# EAGLE design Prova (EAGLE 6.5.0)

## Sheet 1 of 2
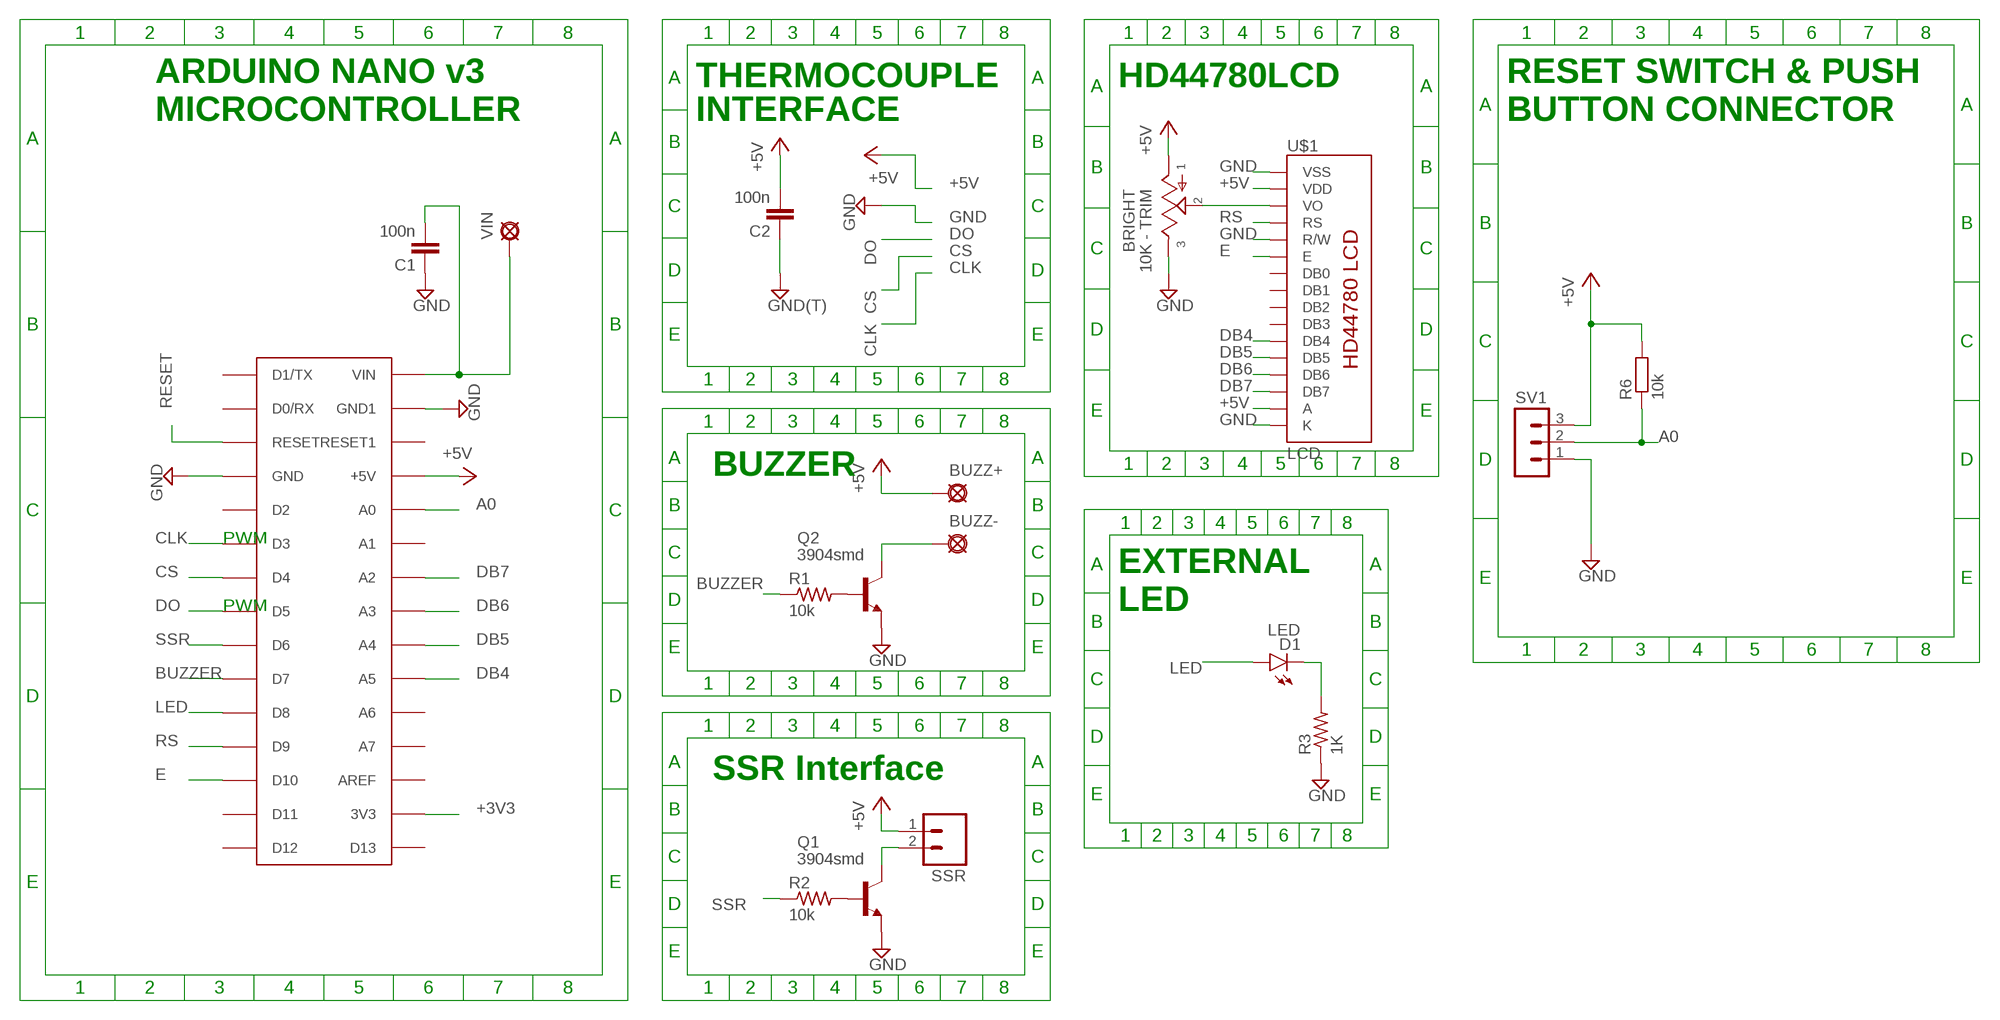
[diagram p0: schematic, sheet 1]

### Parts
ARDUINO  Arduino Nano v3.0  ARDUINONANO  [PDIP-32]
BRIGHT  10K - TRIM  POTTRIM  [B25P]
BUZZ+  PAD  [SQUARE]
BUZZ-  PAD8  [OCTOGON]
C1  100n  CAP0805  [0805]
C2  100n  CAP0805  [0805]
D1  LED  LED3MM  [LED3MM]
GND8  GND(T)  [SQUARE]
Q1  3904smd  BC850SMD  [SOT23-BEC]
Q2  3904smd  BC850SMD  [SOT23-BEC]
R1  10k  6MM.3  [R0207/3]
R2  10k  6MM.3  [R0207/3]
R3  1K  6MM.3  [R0207/3]
R6  10k  R-EU_M0805  [M0805]
SSR  M023.5MM  [SCREWTERMINAL-3.5MM-2]
SV1  MA03-1  [MA03-1]
U$1  LCD  LCD-HD44780  [LCD-16X2-PIN]
VIN  PAD  [SQUARE]

### Nets
+3V3: ARDUINO.3V3 ; also sheet 2
+5V: ARDUINO.+5V BRIGHT.1 BUZZ+.1(PAD) C2.2 R6.2 SSR.1 SV1.3 U$1.2(VDD) U$1.15(A)
A0: ARDUINO.A0 R6.1 SV1.2
BUZZER: ARDUINO.D7 R1.1
CLK: ARDUINO.D3 ; also sheet 2
CS: ARDUINO.D4 ; also sheet 2
DB4: ARDUINO.A5 U$1.11(DB4)
DB5: ARDUINO.A4 U$1.12(DB5)
DB6: ARDUINO.A3 U$1.13(DB6)
DB7: ARDUINO.A2 U$1.14(DB7)
DO: ARDUINO.D5 ; also sheet 2
E: ARDUINO.D10 U$1.6(E)
GND: ARDUINO.GND ARDUINO.GND1 BRIGHT.3 C1.1 C2.1 GND8.1(GND) Q1.E Q2.E R3.1 SV1.1 U$1.1(VSS) U$1.5(R/W) U$1.16(K) ; also sheet 2
LED: ARDUINO.D8 D1.A
N$1: Q2.B R1.2
N$2: Q1.C SSR.2
N$3: Q1.B R2.2
N$4: BUZZ-.1(PAD) Q2.C
N$5: BRIGHT.2 U$1.3(VO)
N$6: D1.K(C) R3.2
RESET: ARDUINO.RESET
RS: ARDUINO.D9 U$1.4(RS)
SSR: ARDUINO.D6 R2.1
VIN: ARDUINO.VIN C1.2 VIN.1(PAD)
Unconnected: ARDUINO.A1 ARDUINO.A6 ARDUINO.A7 ARDUINO.AREF ARDUINO.D0/RX ARDUINO.D1/TX ARDUINO.D2 ARDUINO.D11 ARDUINO.D12 ARDUINO.D13 ARDUINO.RESET1 U$1.7(DB0) U$1.8(DB1) U$1.9(DB2) U$1.10(DB3)

### Notes on the sheet
- THERMOCOUPLE | HD44780LCD
- ARDUINO NANO v3
  MICROCONTROLLER
- INTERFACE
- RESET SWITCH & PUSH
  BUTTON CONNECTOR
- BUZZER
- PWM
- PWM
- EXTERNAL
  LED
- SSR Interface

## Sheet 2 of 2
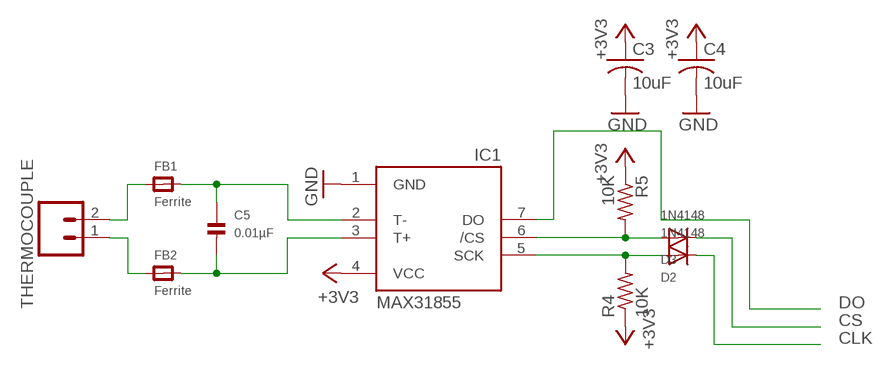
[diagram p1: schematic, sheet 2]

### Parts
C3  10uF  C-USC0805K  [C0805K]
C4  10uF  C-USC0805K  [C0805K]
C5  0.01µF  CAP_CERAMIC_0805  [_0805]
D2  1N4148  DIODEDO-1N4148  [DO-1N4148]
D3  1N4148  DIODEDO-1N4148  [DO-1N4148]
FB1  Ferrite  FERRITE_0805  [_0805]
FB2  Ferrite  FERRITE_0805  [_0805]
IC1  MAX31855  MAX6675  [SO08]
R4  10K  R-US_R0805  [R0805]
R5  10K  R-US_R0805  [R0805]
THERMOCOUPLE  M023.5MM  [SCREWTERMINAL-3.5MM-2]

### Nets
+3V3: C3.1 C4.1 IC1.4(VCC) R4.1 R5.1 ; also sheet 1
CLK: D2.C ; also sheet 1
CS: D3.C ; also sheet 1
CS1: D3.A IC1.6(/CS) R5.2
DO: IC1.7(DO) ; also sheet 1
GND: C3.2 C4.2 IC1.1(GND) ; also sheet 1
N$9: FB1.1 THERMOCOUPLE.2
N$10: C5.1 FB1.2 IC1.2(T-)
N$11: FB2.1 THERMOCOUPLE.1
N$12: C5.2 FB2.2 IC1.3(T+)
SCK: D2.A IC1.5(SCK) R4.2

## Library data of the parts
ARDUINO = jet-lib:ARDUINONANO
BRIGHT = gm-pots:POT: Potentiometers the arrow indicates the clockwise motion of th wiper (lug 2) fully counter clockwise there is no resistance between lugs 1 and 2 fully clockwise the resistance between lugs 1 and 2 is the value of the pot
BUZZ+ BUZZ- VIN = gm-supply:PAD: PAD use this package for pads with any purpose, including input, output, send or return various pad shapes: round, square, octogonal, long, and long offset
C1 C2 = SparkFun-Capacitors:CAP: Capacitor Standard 0603 ceramic capacitor, and 0.1" leaded capacitor.
C3 C4 = adafruit:C-US: CAPACITOR, American symbol
C5 = microbuilder:CAP_CERAMIC: Ceramic Capacitors 0402 - 0402 Surface Mount Capacitors 16pF 50V 5% [Digikey: 445-4899-2-ND] 18pF 50V 5% [Digikey: 490-1281-2-ND] 22pF 50V 5% [Digikey: 490-1283-2-ND] 68pF 50V 5% [Digikey: 490-1289-2-ND] 0.1uF 10V 10% [Digikey: 490-1318-2-ND] 1.0uF 6.3V 10% [Digikey: 490-1320-2-ND] 0603 - 0603 Surface Mount Capacitors 16 pF 50V 5% [Digikey: 445-5051-2-ND] 22 pF 50V [Digikey: PCC220ACVTR-ND] 33 pF 50V 5% [Digikey: 490-1415-1-ND] 56pF 50V 5% [Digikey: 490-1421-1-ND] 220pF 50V 5% [Digikey: 445-1285-1-ND] 680 pF 50V 2200 pF 50V 5% C0G [Digikey: 445-1297-1-ND] 5600 pF 100V 5% X7R [Digikey: 478-3711-1-ND] 0.1 µF 25V 10% [Digikey: PCC2277TR-ND] 0.22 µF 16V 10% X7R [Digikey: 445-1318-1-ND] 1.0 µF 25V 10% [Digikey: 445-5146-2-ND] 0603 - RF Specific 3pF 250V +/-0.1pF RF [Digikey: 712-1347-1-ND] 18 pF 250V 5% [Digikey: 478-3505-1-ND or 712-1322-1-ND] 56 pF 250V 5% C0G RF [Digikey: 490-4867-1-ND] 68 pF 250V RF [Digikey: 490-4868-1-ND] 0805 - 0805 Surface Mount Capacitors 220 pF 250V 2% RF Ceramic Capacitor [Digikey: 712-1398-1-ND] 1000 pF 50V 2% NP0 Ceramic Capacitor [Digikey: 478-3760-1-ND] 0.1 µF 25V 10% Ceramic Capacitor [Digikey: PCC1828TR-ND] 1.0 µF 16V 10% Ceramic Capacitor[Digikey: 490-1691-2-ND] 10.0 µF 10V 10% Ceramic Capacitor[Digikey: 709-1228-1-ND] 10.0 uF 16V 10% Ceramic Capacitor [Digikey: 478-5165-2-ND] 47 uF 6.3V 20% Ceramic Capacitor [Digikey: 587-1779-1-ND or 399-5506-1-ND] 1206 - 1206 Surface Mount Capacitors 47uF 10V 20% Ceramic Capacitor [Digikey: 490-5528-1-ND or 399-5508-1-ND or 445-6010-1-ND] 100uF 6.3V -20%, +80% Y5V Ceramic Capacitor (Digikey: 490-4512-1-ND, Mouser: 81-GRM31CF50J107ZE1L)
D1 = gm-diodes:LED
D2 D3 = adafruit:DIODE: Diode SMADIODE - SMA Surface Mount Package 20V 1A Schottky Diode Digikey: 641-1014-6-ND DO-1N4148 - Through Hole Small Current Diode SOD-123 20V 1 A (.5mV Vf) Schottky Diode - Digikey: MBRX120TPMSCT-ND SOD-323 10V 570mA (.38mV Vf, 3ns) Schottky Diode - Digikey: ZLLS410CT-ND SOD-523 30V 30mA Schottky Diode (RB751S-40TE61) - Digikey: RB751S-40TE61CT-ND SOT23-R/W - SOT23 Package (R = Solder Paste/Reflow Ovens, W = Hand-Soldering) BAT54Film 40V 300mA - Digikey: 497-7162-1-ND
FB1 FB2 = microbuilder:FERRITE: Ferrite Bead 0603 MMZ1608B121C - 120 Ohm @ 100MHz, 600mA, 0.15 Ohm DC Resistance - Digikey: 445-2164-1-ND BK1608HW121-T - 120 Ohm, 600mA Ferrite Chip - Digikey: 587-1876-2-ND 0805 HZ0805B272R-10 - 2.7K Ohm @ 100MHz, 200mA, 0.8 Ohm DC Resistance - Digikey: 240-2504-1-ND (see also Murata BLM21BD272SN1L) MMZ2012Y152B - 1.5K Ohm @ 100MHz, 500mA, 0.4 Ohm DC Resistance - Digikey: 445-1560-1-ND - Mainly for high frequency (80-400MHz) MMZ2012R102A - 1K Ohm @ 100MHz, 500mA, 0.3 Ohm DC Resistance - Digikey: 445-1555-2-ND - More general purpose (10-200MHz)
GND8 = gm-supply:GND(T): Ground use this to hook up ground (GND) throughout a schematic instead of running wire automatically labels the net "GND" adds a hookup pad to the circuit board (you can use several)
IC1 = adafruit:MAX6675
Q1 Q2 = transistor-npn:BC850*: NPN Transistor
R1-R3 = gm-resistors:6MM: 6mm Resistors Leads spaced 1-6 holes apart for 0.1" perfboard. Suitable for 1/4 watt resistors.
R4 R5 = adafruit:R-US_: RESISTOR, American symbol
R6 = rcl:R-EU_: RESISTOR, European symbol
SSR THERMOCOUPLE = SparkFun-Connectors:M02: Standard 2-pin 0.1" header. Use with - straight break away headers ( PRT-00116) - right angle break away headers (PRT-00553) - swiss pins (PRT-00743) - machine pins (PRT-00117) - female headers (PRT-00115) Molex polarized connector foot print use with: PRT-08233 with associated crimp pins and housings. 2.54_SCREWTERM for use with PRT-10571. 3.5mm Screw Terminal footprints for PRT-08084 5mm Screw Terminal footprints for use with PRT-08432; PROD_ID: CONN-08399
SV1 = con-lstb:MA03-1: PIN HEADER; OC_FARNELL: unknown; OC_NEWARK: unknown
U$1 = HD44780LCD:LCD-HD44780

## Board
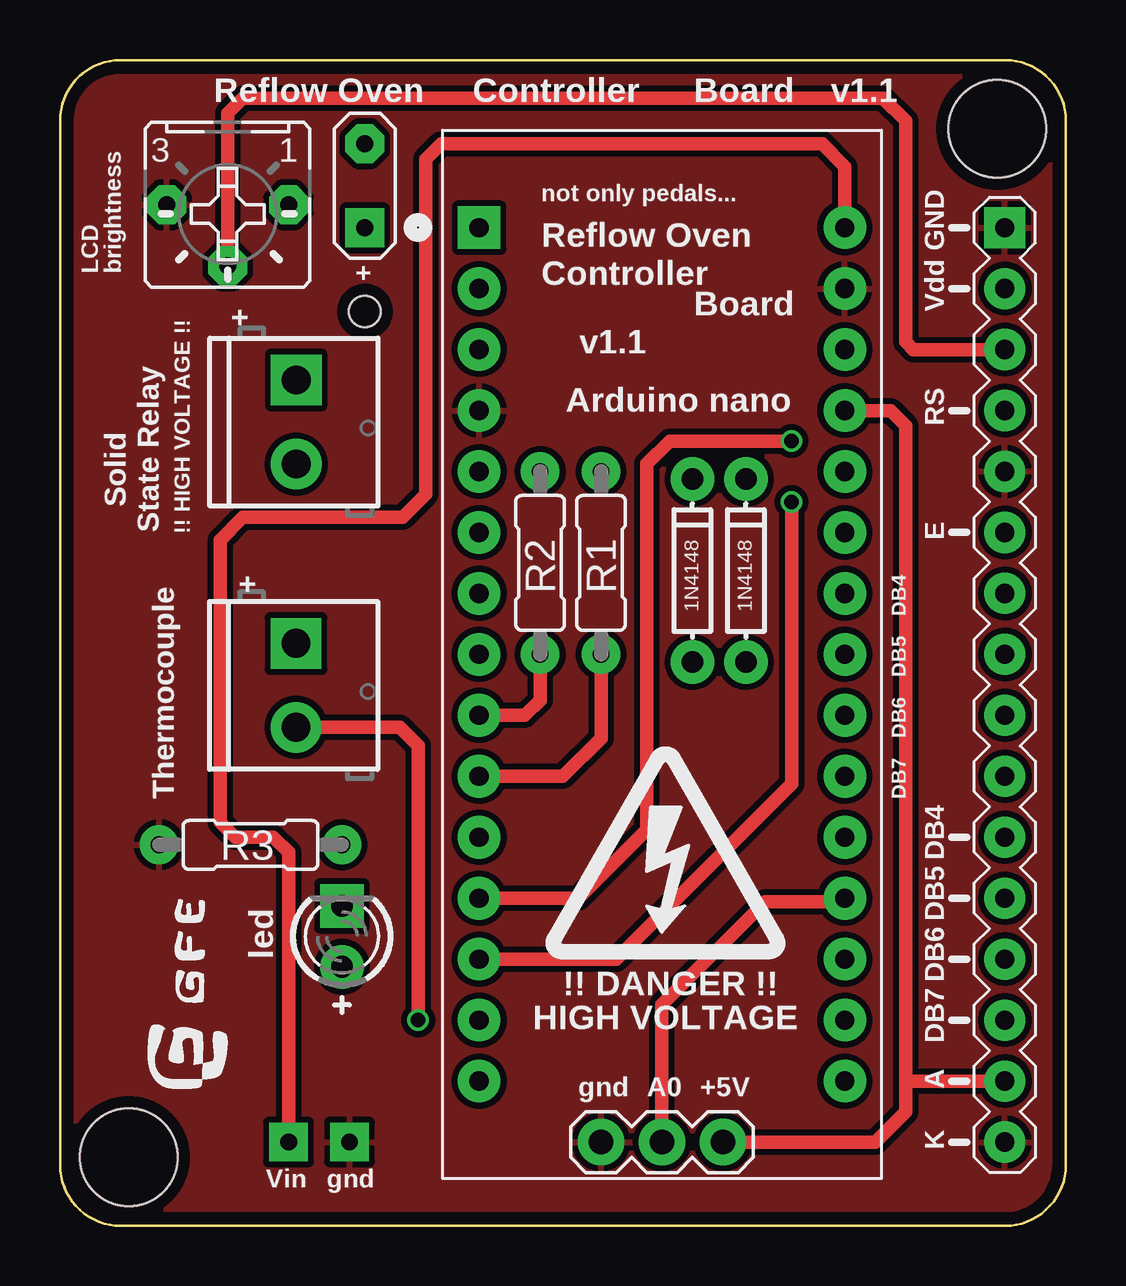
[diagram p2: board, top side]
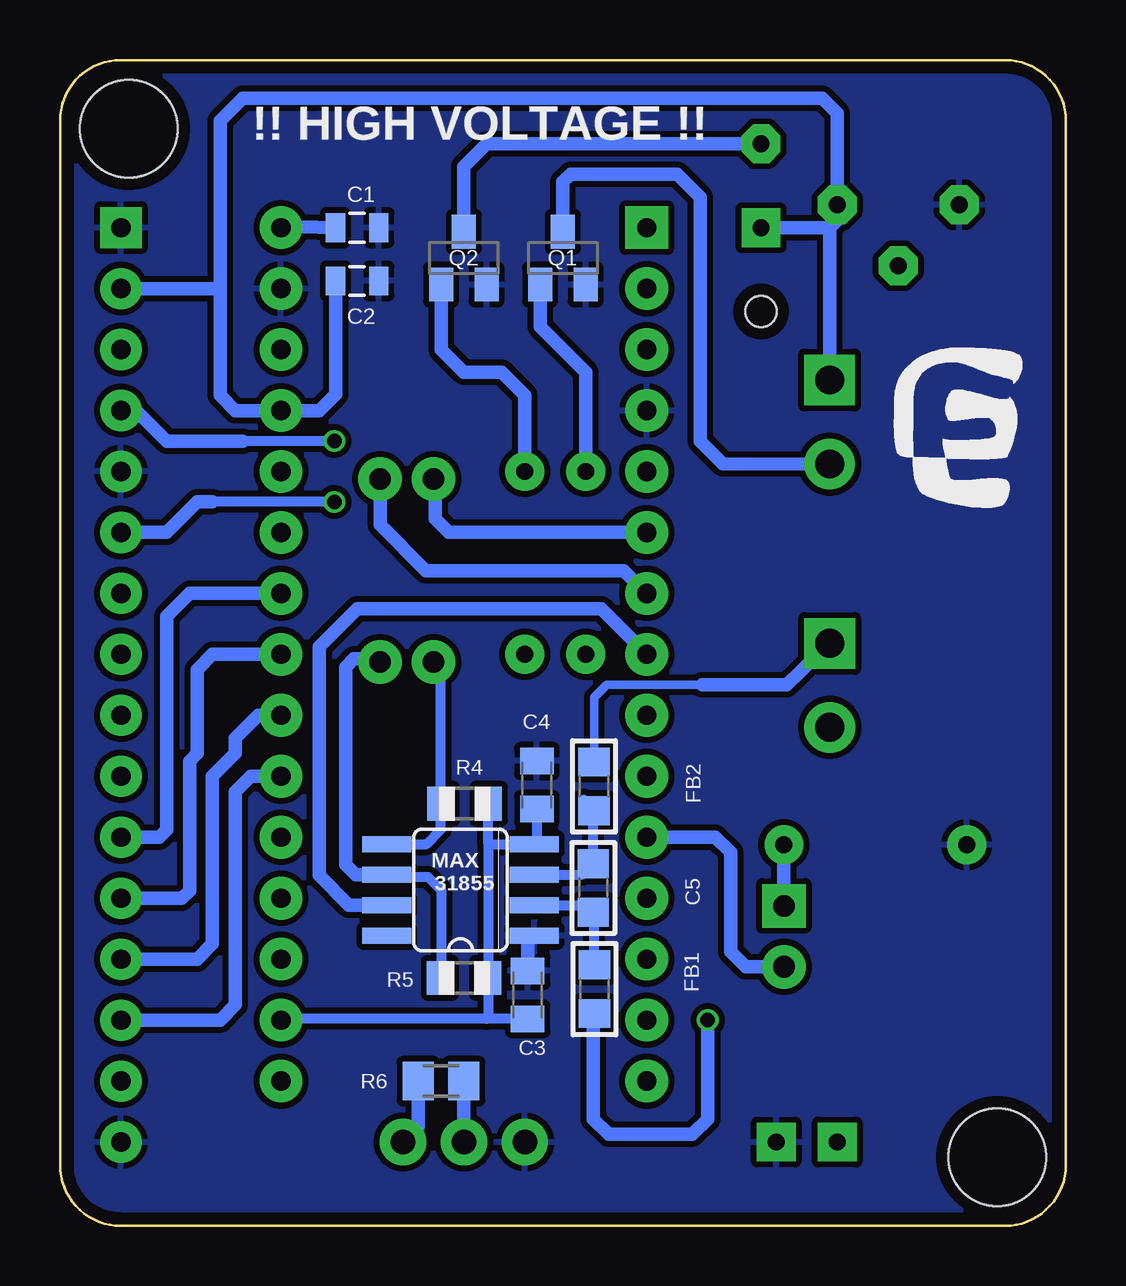
[diagram p3: board, bottom side, seen from below]

Size 41.91 x 48.58 mm. Coordinates in mm from the lower left corner, seen from the top.
Outline: 0,46.04 arc-90 2.54,48.58 39.37,48.58 arc-90 41.91,46.04 41.91,2.54 arc-90 39.37,0 2.54,0 arc-90 0,2.54 0,46.04
Copper layers (1*16): Top 0.035mm / dielectric 1.5mm / Bottom 0.035mm
Design rules "Smart Prototyping": minimum track width 7mil, minimum drill 12mil, track to track 7mil, track to pad 7mil, pad to pad 7mil, via to via 7mil, smd to smd 0mil, copper to edge 20mil, drill to drill 10mil, minimum pad ring 18mil, minimum via ring 6mil, stop-mask expansion 2mil, vias tented up to drill 25mil, thermal gap 10mil
Holes 4.06 mm at 2.86,2.86 39.05,45.72
Holes 1.3 mm at 12.7,38.1

### Footprints (pad centres in the part's own frame; a part is rotated, then mirrored left to right if it is on the bottom)
PDIP-32 = drill 0.8 pad 1.778: 3V3 15.24,-35.56; +5V 15.24,-10.16; A0 15.24,-30.48; A1 15.24,-27.94; A2 15.24,-25.4; A3 15.24,-22.86; A4 15.24,-20.32; A5 15.24,-17.78; A6 15.24,-15.24; A7 15.24,-12.7; AREF 15.24,-33.02; D0/RX 0,-5.08; D2 0,-12.7; D3 0,-15.24; D4 0,-17.78; D5 0,-20.32; D6 0,-22.86; D7 0,-25.4; D8 0,-27.94; D9 0,-30.48; D10 0,-33.02; D11 0,-35.56; D12 0,-38.1; D13 15.24,-38.1; GND 0,-10.16; GND1 15.24,-5.08; RESET 0,-7.62; RESET1 15.24,-7.62; VIN 15.24,-2.54 | drill 0.8 pad 1.778 square: D1/TX 0,-2.54
B25P = drill 0.7 octagon: 1 -2.54,0; 2 0,2.54; 3 2.54,0
SQUARE = drill 0.7 square: 1 0,0
OCTOGON = drill 0.7 octagon: 1 0,0
0805 = smd 0.8 x 1.2: 1 -0.9,0; 2 0.9,0
C0805K = smd 1.1 x 1.4: 1 -1,0; 2 1,0
_0805 = smd 1.2 x 1.3: 1 -1.016,0; 2 1.016,0
LED3MM = drill 0.9: A -1.27,0 | drill 0.9 square: K 1.27,0
DO-1N4148 = drill 0.9: A -3.81,0; C 3.81,0
SO08 = smd 0.66 x 2.032: 1 -1.905,-3.073; 2 -0.635,-3.073; 3 0.635,-3.073; 4 1.905,-3.073; 5 1.905,3.073; 6 0.635,3.073; 7 -0.635,3.073; 8 -1.905,3.073
SOT23-BEC = smd 1 x 1.4: B -0.95,-1.1; C 0,1.1; E 0.95,-1.1
R0207/3 = drill 0.7: 1 -3.81,0; 2 3.81,0
R0805 = smd 1.1 x 1.4: 1 -1,0; 2 1,0
M0805 = smd 1.3 x 1.6: 1 -0.95,0; 2 0.95,0
SCREWTERMINAL-3.5MM-2 = drill 1.2 pad 2.032 square: 1 0,0 | drill 1.2 pad 2.032: 2 3.5,0
MA03-1 = drill 1.016: 1 -2.54,0; 2 0,0; 3 2.54,0
LCD-16X2-PIN = drill 0.8 square: 1 -19.05,0 | drill 0.8: 2 -16.51,0; 3 -13.97,0; 4 -11.43,0; 5 -8.89,0; 6 -6.35,0; 7 -3.81,0; 8 -1.27,0; 9 1.27,0; 10 3.81,0; 11 6.35,0; 12 8.89,0; 13 11.43,0; 14 13.97,0; 15 16.51,0; 16 19.05,0

### Placement (x,y rotation side)
ARDUINO  17.46,44.13 0 top
BRIGHT  6.99,42.55 180 top
BUZZ+  12.7,41.59 270 top
BUZZ-  12.7,45.09 270 top
C1  29.53,41.59 180 bottom
C2  29.53,39.37 180 bottom
C3  22.43,9.63 90 bottom
C4  22.04,18.37 90 bottom
C5  19.68,14.08 90 bottom
D1  11.75,12.06 90 top
D2  26.35,27.3 90 top
D3  28.57,27.3 90 top
FB1  19.64,9.87 90 bottom
FB2  19.66,18.31 270 bottom
GND8  12.06,3.49 90 top
IC1  25.22,14 90 bottom
Q1  20.95,40.32 0 bottom
Q2  25.08,40.32 0 bottom
R1  22.54,27.62 90 top
R2  20,27.62 90 top
R3  7.94,15.88 0 top
R4  25.05,17.59 180 bottom
R5  25.07,10.33 180 bottom
R6  26.04,6.03 180 bottom
SSR  9.84,35.24 270 top
SV1  25.08,3.49 0 top
THERMOCOUPLE  9.84,24.27 270 top
U$1  39.37,22.54 270 top
U$2  [LOGO_SCRITTA]  6.99,5.71 90 top
U$3  [RADIOACTIVE_10.00]  20,11.11 0 top
U$4  [LOGO-GRANDE]  7.16,29.91 0 bottom
VIN  9.53,3.49 90 top

### Tracks (layer width: path | path; a pad name or v marks a point on that pad's centre or on a via)
+3V3
  Bottom 0.305: 22.21,15.96 IC1.4 22.04,16.01 | R4.1 24.11,17.59 24.14,17.62 | 24.01,15.9 24,15.91
  Bottom 0.356: 24.07,15.98 24,15.91
  Bottom 0.406: 24,15.91 IC1.4 | C4.1 22.04,16.01 | R4.1 24.07,17.57 24.07,15.98 R5.1 24.07,8.68 24.13,8.63 | C3.1 24.13,8.63 | 24.13,8.63 32.65,8.63 ARDUINO.3V3
+5V
  Top 0.559: U$1.15 35.24,6.03 | 35.24,6.03 35.24,33.34 34.61,33.97 ARDUINO.+5V | SV1.3 33.97,3.49 35.24,4.76 35.24,6.03
  Bottom 0.559: U$1.2 35.24,39.05 | 35.24,39.05 35.24,34.61 34.61,33.97 ARDUINO.+5V 31.11,33.97 30.43,34.66 C2.2 | 35.24,39.05 35.24,46.04 34.29,46.99 10.16,46.99 9.53,46.35 BRIGHT.1 9.53,41.91 9.84,41.59 | BUZZ+.1 9.84,41.59 | SSR.1 9.84,41.59 | R6.2 26.98,4.13 SV1.3
A0
  Top 0.559: ARDUINO.A0 32.56,13.51 29.39,13.51 25.08,9.21 SV1.2
  Bottom 0.559: R6.1 SV1.2
BUZZER
  Top 0.559: R1.1 22.54,20.32 20.95,18.73 ARDUINO.D7
CLK
  Bottom 0.559: ARDUINO.D3 25.72,28.89 26.28,29.46 26.28,31.05 D2.C
CS
  Bottom 0.559: ARDUINO.D4 18.41,27.3 26.67,27.3 28.57,29.21 D3.C
CS1
  Bottom 0.305: 28.2,14.54 IC1.6
  Bottom 0.406: 28.2,14.54 26.57,14.54 26.01,13.97 26.01,10.33 R5.2
  Bottom 0.559: IC1.6 29.59,14.63 30,15.05 30,23.29 29.66,23.63 28.71,23.63 D3.A
DB4
  Bottom 0.559: U$1.11 37.78,16.19 37.47,16.51 37.47,25.4 36.51,26.35 ARDUINO.A5
DB5
  Bottom 0.559: ARDUINO.A4 35.56,23.81 36.2,23.18 36.2,19.68 36.51,19.37 36.51,13.97 36.83,13.65 U$1.12
DB6
  Bottom 0.559: U$1.13 36.2,11.11 35.56,11.75 35.56,18.73 34.61,19.68 34.61,20.32 33.66,21.27 ARDUINO.A3
DB7
  Bottom 0.559: U$1.14 35.24,8.57 34.61,9.21 34.61,18.1 33.97,18.73 ARDUINO.A2
DO
  Bottom 0.559: IC1.7 29.87,13.36 31.11,14.61 31.11,24.13 29.53,25.72 19.37,25.72 ARDUINO.D5
E  (via drill 0.6)
  Top 0.559: ARDUINO.D10 23.18,11.11 30.48,18.41 v30.48,30.16
  Bottom 0.406: v30.48,30.16 35.56,30.16
  Bottom 0.559: 35.56,30.16 36.2,30.16 37.47,28.89 U$1.6
GND
  Bottom 0.305: 22.43,11.81 IC1.1
  Bottom 0.559: C3.2 22.43,11.81
  pour Bottom (isolate 0.254): -5.71,-6.99 46.99,-6.35 46.99,53.66 -5.71,53.02
  pour Top (isolate 0.254): -2.54,51.12 43.81,51.12 43.81,-2.86 -2.54,-2.86
LED
  Bottom 0.559: ARDUINO.D8 14.61,16.19 13.97,15.56 13.97,11.43 13.34,10.79 D1.A
N$1
  Bottom 0.559: Q2.B 26.03,36.51 25.08,35.56 23.5,35.56 22.54,34.61 R1.2
N$2
  Bottom 0.559: Q1.C 20.95,43.5 20.64,43.81 16.19,43.81 15.24,42.86 15.24,32.7 14.29,31.75 SSR.2
N$3
  Bottom 0.559: Q1.B 21.91,37.46 20,35.56 R2.2
N$4
  Bottom 0.559: Q2.C 25.08,44.13 24.13,45.09 BUZZ-.1
N$5
  Top 0.559: U$1.3 35.56,36.51 35.24,36.83 35.24,46.04 34.29,46.99 7.62,46.99 6.99,46.35 BRIGHT.2
N$6
  Bottom 0.559: R3.2 D1.K
N$9  (via drill 0.6)
  Top 0.559: THERMOCOUPLE.2 14.15,20.77 14.92,20 v14.92,8.57
  Bottom 0.406: 19.68,8.81 FB1.1
  Bottom 0.559: 19.68,8.81 19.68,4.45 19.05,3.81 15.56,3.81 14.92,4.45 v14.92,8.57
N$10
  Bottom 0.406: IC1.2 19.68,13.36 C5.1 19.64,13.06 FB1.2
N$11
  Bottom 0.356: FB2.1 19.66,22.02 19.14,22.54 15.14,22.54
  Bottom 0.559: THERMOCOUPLE.1 11.62,22.54 15.14,22.54
N$12
  Bottom 0.305: FB2.2 20.08,17.81 19.72,17.45 | 19.72,15.13 C5.2
  Bottom 0.356: 20.15,14.63 C5.2
  Bottom 0.406: IC1.3 20.15,14.63 | 19.72,17.45 19.72,15.13
RS  (via drill 0.6)
  Top 0.559: v30.48,32.7 25.4,32.7 24.45,31.75 24.45,16.51 21.59,13.65 ARDUINO.D9
  Bottom 0.406: v30.48,32.7 34.29,32.7
  Bottom 0.559: 34.29,32.7 37.47,32.7 38.73,33.97 U$1.4
SCK
  Bottom 0.305: IC1.5
  Bottom 0.406: IC1.5 26.64,15.91 26.04,16.51 26.04,17.57 R4.2 26.05,23.19 D2.A
SSR
  Top 0.559: R2.1 20,21.91 19.37,21.27 ARDUINO.D6
VIN
  Top 0.559: VIN.1 9.53,15.56 8.89,16.19 7.3,16.19 6.67,16.83 6.67,28.57 7.62,29.53 14.29,29.53 15.24,30.48 15.24,44.45 15.88,45.09 31.75,45.09 32.7,44.13 ARDUINO.VIN
  Bottom 0.559: C1.2 32.65,41.65 ARDUINO.VIN

### Text on the board
tPlace: Reflow Oven | Controller | Board | v1.1 | not only pedals... | Reflow Oven | GND | LCD | brightness | + | Controller | !! HIGH VOLTAGE !! | Board | Vdd | + | v1.1 | Arduino nano | RS | Solid / State Relay | E | + | DB4 | DB5 | DB6 | Thermocouple | DB7 | DB4 | DB5 | led | !! DANGER !! | DB6 | HIGH VOLTAGE | DB7 | A | gnd | A0 | +5V | K | Vin | gnd
bPlace: !! HIGH VOLTAGE !!
bNames: MAX | 31855